# EAGLE schematic LED_battary (EAGLE 7.7.0)

## Sheet 1 of 4: Voltage Regulator
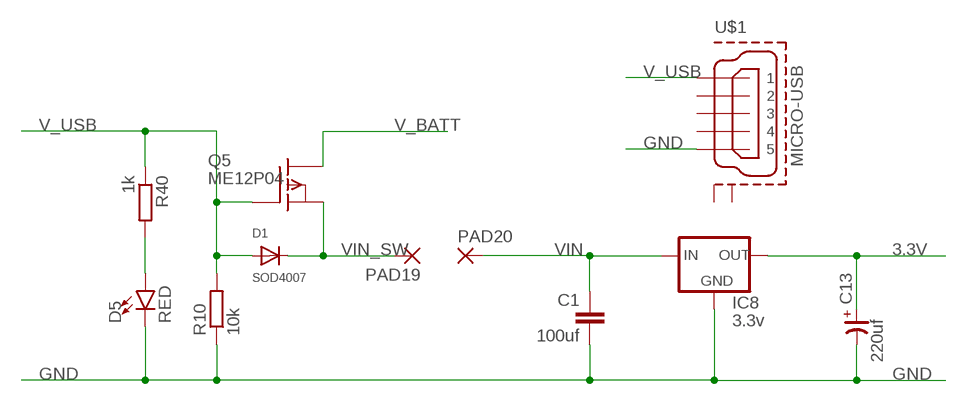
[diagram p0: schematic, sheet 1]

### Parts
C1  100uf  C-EUC1206K  [C1206K]
C13  220uf  CP-7343  [7343/T]
D1  SOD4007  DIODE_SOD-123FL  [SOD-123FL]
D5  RED  LED-GREEN1206  [LED-1206]
IC8  3.3v  LM1117TO252  [TO252]
PAD19  SMD2  [SMD1,27-2,54]
PAD20  SMD2  [SMD1,27-2,54]
Q5  ME12P04  IRF9530  [TO220]
R10  10k  R-EU_0207/10  [0207/10]
R40  1k  R-EU_0207/10  [0207/10]
U$1  MICRO-USB  MICRO-USB-RECEPTACLE47589-0001  [47589-0001]

### Nets
3.3V: C13.+ IC8.3(OUT) ; also sheet 3,4
GND: C1.2 C13.- D5.C IC8.1(GND) R10.1 U$1.5 ; also sheet 2,3,4
N$1: D5.A R40.2
V_BATT: Q5.2(D) ; also sheet 2,4
V_USB: D1.A Q5.1(G) R10.2 R40.1 U$1.1 ; also sheet 2,4
VIN: C1.1 IC8.2(IN) PAD20.1(P)
VIN_SW: D1.C PAD19.1(P) Q5.3(S)
Unconnected: U$1.2 U$1.3 U$1.4 U$1.P$1(GND1) U$1.P$2(GND2)

## Sheet 2 of 4: Lithium-Polymer Battery Charger (1-cell)
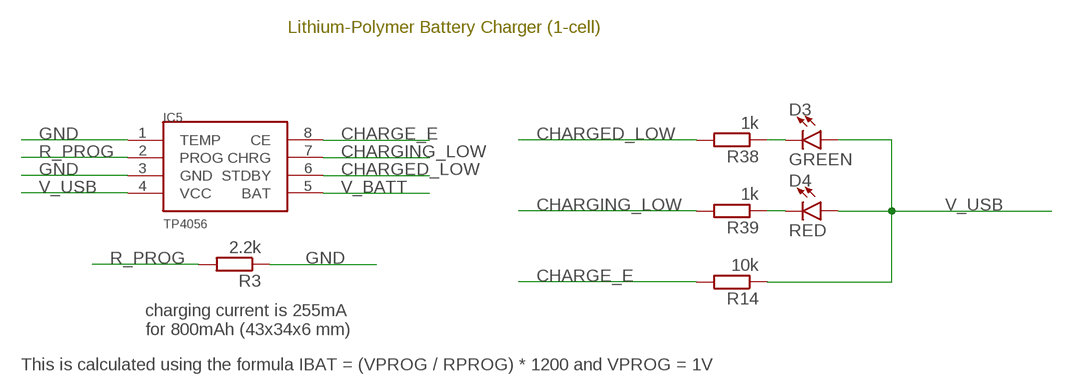
[diagram p1: schematic, sheet 2]

### Parts
D3  GREEN  LED-GREEN1206  [LED-1206]
D4  RED  LED-GREEN1206  [LED-1206]
IC5  TP4056  [SOP-8]
R3  2.2k  R-EU_0207/10  [0207/10]
R14  10k  R-EU_0207/10  [0207/10]
R38  1k  R-EU_0207/10  [0207/10]
R39  1k  R-EU_0207/10  [0207/10]

### Nets
CHARGE_E: IC5.8(CE) R14.2
CHARGED_LOW: IC5.6(STDBY) R38.2
CHARGING_LOW: IC5.7(CHRG) R39.2
GND: IC5.1(TEMP) IC5.3(GND) R3.1 ; also sheet 1,3,4
N$2: D4.C R39.1
N$4: D3.C R38.1
R_PROG: IC5.2(PROG) R3.2
V_BATT: IC5.5(BAT) ; also sheet 1,4
V_USB: D3.A D4.A IC5.4(VCC) R14.1 ; also sheet 1,4

### Notes on the sheet
- Lithium-Polymer Battery Charger (1-cell)
- charging current is 255mA
  for 800mAh (43x34x6 mm)
- This is calculated using the formula IBAT = (VPROG / RPROG) * 1200 and VPROG = 1V

## Sheet 3 of 4: LED Driver
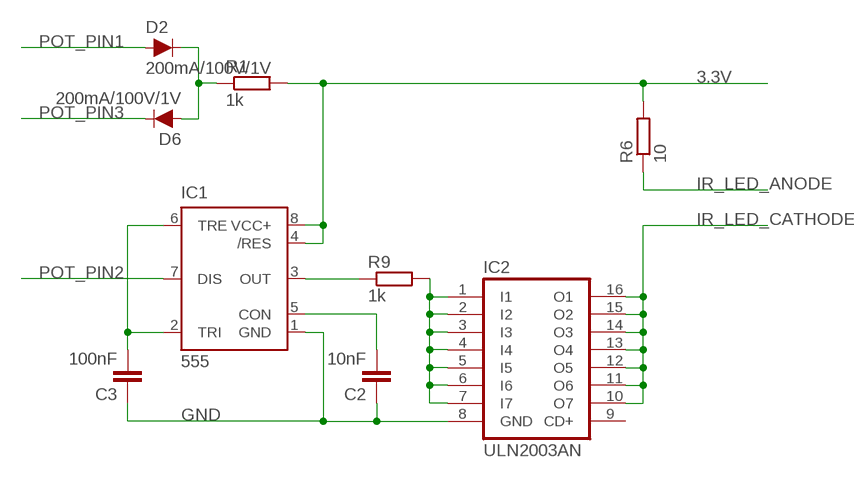
[diagram p2: schematic, sheet 3]

### Parts
C2  10nF  C-EUC1206K  [C1206K]
C3  100nF  C-EUC1206K  [C1206K]
D2  200mA/100V/1V  DIODE-1N4148  [DIODE-1N4148]
D6  200mA/100V/1V  DIODE-1N4148  [DIODE-1N4148]
IC1  555  555P  [DIP08]
IC2  ULN2003AN  [DIL16]
R1  1k  R-EU_0207/10  [0207/10]
R6  10  R-EU_0207/10  [0207/10]
R9  1k  R-EU_0207/10  [0207/10]

### Nets
3.3V: IC1.4(/RES) IC1.8(VCC+) R1.2 R6.2 ; also sheet 1,4
GND: C2.1 C3.1 IC1.1(GND) IC2.8(GND) ; also sheet 1,2,4
IR_LED_ANODE: R6.1
IR_LED_CATHODE: IC2.10(O7) IC2.11(O6) IC2.12(O5) IC2.13(O4) IC2.14(O3) IC2.15(O2) IC2.16(O1)
N$3: IC1.3(OUT) R9.1
N$5: C2.2 IC1.5(CON)
N$6: C3.2 IC1.2(TRI) IC1.6(TRE)
N$7: IC2.1(I1) IC2.2(I2) IC2.3(I3) IC2.4(I4) IC2.5(I5) IC2.6(I6) IC2.7(I7) R9.2
N$9: D2.C D6.A R1.1
POT_PIN1: D2.A
POT_PIN2: IC1.7(DIS)
POT_PIN3: D6.C
Unconnected: IC2.9(CD+)

## Sheet 4 of 4: OLED LCD and Connectors
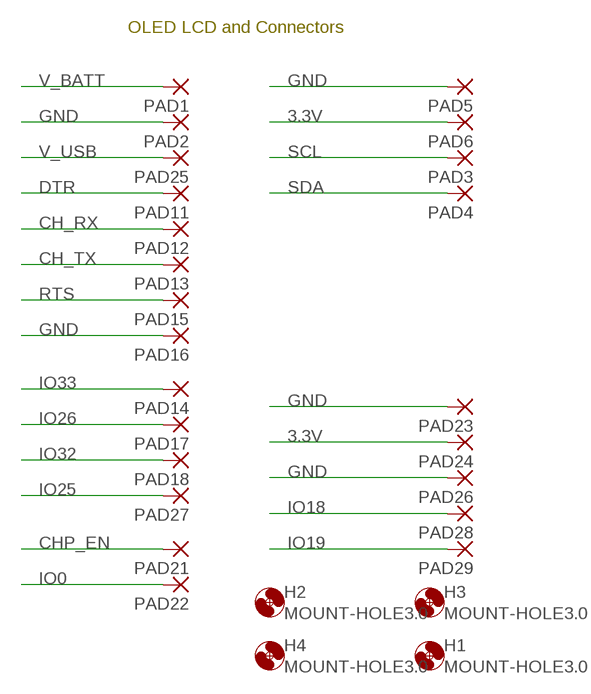
[diagram p3: schematic, sheet 4]

### Parts
H1  MOUNT-HOLE3.0  [3,0]
H2  MOUNT-HOLE3.0  [3,0]
H3  MOUNT-HOLE3.0  [3,0]
H4  MOUNT-HOLE3.0  [3,0]
PAD1  WIREPADSMD5-2,5  [5-2,5]
PAD2  WIREPADSMD5-2,5  [5-2,5]
PAD3  SMD2  [SMD1,27-2,54]
PAD4  SMD2  [SMD1,27-2,54]
PAD5  SMD2  [SMD1,27-2,54]
PAD6  SMD2  [SMD1,27-2,54]
PAD11  SMD2  [SMD1,27-2,54]
PAD12  SMD2  [SMD1,27-2,54]
PAD13  SMD2  [SMD1,27-2,54]
PAD14  SMD2  [SMD1,27-2,54]
PAD15  SMD2  [SMD1,27-2,54]
PAD16  SMD2  [SMD1,27-2,54]
PAD17  SMD2  [SMD1,27-2,54]
PAD18  SMD2  [SMD1,27-2,54]
PAD21  SMD2  [SMD1,27-2,54]
PAD22  SMD2  [SMD1,27-2,54]
PAD23  SMD2  [SMD1,27-2,54]
PAD24  SMD2  [SMD1,27-2,54]
PAD25  SMD2  [SMD1,27-2,54]
PAD26  SMD2  [SMD1,27-2,54]
PAD27  SMD2  [SMD1,27-2,54]
PAD28  SMD2  [SMD1,27-2,54]
PAD29  SMD2  [SMD1,27-2,54]

### Nets
3.3V: PAD6.1(P) PAD24.1(P) ; also sheet 1,3
CH_RX: PAD12.1(P)
CH_TX: PAD13.1(P)
CHP_EN: PAD21.1(P)
DTR: PAD11.1(P)
GND: PAD2.1(P) PAD5.1(P) PAD16.1(P) PAD23.1(P) PAD26.1(P) ; also sheet 1,2,3
IO0: PAD22.1(P)
IO18: PAD28.1(P)
IO19: PAD29.1(P)
IO25: PAD27.1(P)
IO26: PAD17.1(P)
IO32: PAD18.1(P)
IO33: PAD14.1(P)
RTS: PAD15.1(P)
SCL: PAD3.1(P)
SDA: PAD4.1(P)
V_BATT: PAD1.1(P) ; also sheet 1,2
V_USB: PAD25.1(P) ; also sheet 1,2

### Notes on the sheet
- OLED LCD and Connectors

## Library data of the parts
C1-C3 = rcl:C-EU: CAPACITOR, European symbol
C13 = cap-master:CP-: POLARIZED CAP
D1 = adafruit:DIODE: Diode
D2 D6 = SparkFun-DiscreteSemi:DIODE: Diode; PROD_ID: DIO-08378
D3 = SparkFun-LED:LED-GREEN: Green SMD LED Used in manufacturing of various products at SparkFun Packages: 0603 - SMD 0603 package [Product Link] <http://www.futureelectronics.com/en/technologies/semiconductors/optoelectronics/leds/Pages/9894312-LTST-C190GKT.aspx?CrossPart=HSMG-C190&IM=0> LilyPad 1206 - SMD1206 LilyPad package [Product Link] <http://www.futureelectronics.com/en/Technologies/Product.aspx?ProductID=IN150NGHARVATEKCORPORATION2049943&IM=0> 1206 - SMD1206 package [Product Link] <http://www.futureelectronics.com/en/technologies/semiconductors/optoelectronics/leds/Pages/8315665-LTST-C150KGKT.aspx?IM=0> 1206 Bottom Mount -SMD 1206 Bottom Mount [Product Link] <http://www.digikey.com/product-detail/en/lite-on-inc/LTST-C230KGKT/160-1456-1-ND/386854> SparkFun Products: Pro Mini 328 -5V <https://www.sparkfun.com/products/821> RedBoard <https://www.sparkfun.com/products/12757> MP3 Trigger <https://www.sparkfun.com/products/13720> Makey Makey <https://www.sparkfun.com/products/11076>; PROD_ID: DIO-00862
D4 D5 = SparkFun-LED:LED-GREEN: Green SMD LED Used in manufacturing of various products at SparkFun Packages: 0603 - SMD 0603 package [Product Link] <http://www.futureelectronics.com/en/technologies/semiconductors/optoelectronics/leds/Pages/9894312-LTST-C190GKT.aspx?CrossPart=HSMG-C190&IM=0> LilyPad 1206 - SMD1206 LilyPad package [Product Link] <http://www.futureelectronics.com/en/Technologies/Product.aspx?ProductID=IN150NGHARVATEKCORPORATION2049943&IM=0> 1206 - SMD1206 package [Product Link] <http://www.futureelectronics.com/en/technologies/semiconductors/optoelectronics/leds/Pages/8315665-LTST-C150KGKT.aspx?IM=0> 1206 Bottom Mount -SMD 1206 Bottom Mount [Product Link] <http://www.digikey.com/product-detail/en/lite-on-inc/LTST-C230KGKT/160-1456-1-ND/386854> SparkFun Products: Pro Mini 328 -5V <https://www.sparkfun.com/products/821> RedBoard <https://www.sparkfun.com/products/12757> MP3 Trigger <https://www.sparkfun.com/products/13720> Makey Makey <https://www.sparkfun.com/products/11076>; PROD_ID: DIO-00862; VALUE: GREEN
H1-H4 = holes:MOUNT-HOLE: MOUNTING HOLE with drill center marker
IC1 = SparkFun-IC-Special-Function:555: General purpose bipolar Timer Datasheet <http://www.sparkfun.com/datasheets/Components/General/ne555.pdf> SparkFun Products SparkFun SparkPunk Sequencer Kit <https://www.sparkfun.com/products/12707> (KIT-12707) Storefront Component: 555 Timer <https://www.sparkfun.com/products/9273> (COM-09273) Two parts valid for production: VFP: IC-11930 (M7555 PTH) VFP: IC-09173 (555 PTH) - Preferred; PROD_ID: IC-09173; PROD_ID_ALT: IC-09173
IC2 = uln-udn:ULN2003A: DRIVER ARRAY
IC5 = TP4056:TP4056
IC8 = v-reg-2:LM1117
PAD1 PAD2 = wirepad:WIREPAD: Wire PAD connect wire on PCB
PAD3-PAD6 PAD11-PAD29 = wirepad@1:SMD2: SMD PAD
Q5 = transistor-fet:IRF9530: P-Channel Enhancement MOSFET (HEXFET); -100V; -12A; 0,3Ohm
R1 R3 R6 R9 R10 R14 R38-R40 = rcl:R-EU_: RESISTOR, European symbol
U$1 = con-molex-usb:MICRO-USB-RECEPTACLE: MICRO USB RECEPTACLES Micro-USB Receptacles, SMT, Lead-Free from MOLEX <http://www.molex.com/>. (C) 2014 Tomasz Boleslaw CEDRO, cederom@tlen.pl, http://www.tomek.cedro.info. Version 0.1 (2014-01-17): Initial release. Version 0.2 (2014-02-06): Updated 47589-0001 footprint pins/pads/milling. Following devices are included: 1. 47589-0001 Micro-USB AB Receptacle, Bottom Mount, SMT, Lead-Free <http://www.molex.com/molex/products/datasheet.jsp?part=active/0475890001_IO_CONNECTORS.xml> (Technical Drawing <http://www.molex.com/pdm_docs/sd/475890001_sd.pdf>).